# EAGLE schematic AirSensor_LoRA (EAGLE 9.6.2)
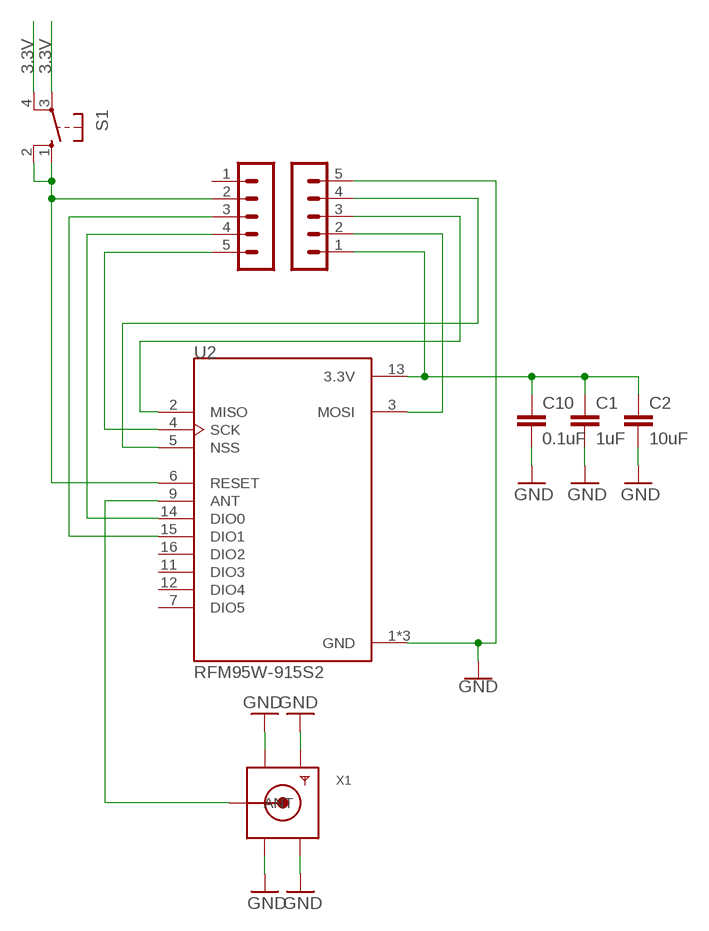
[diagram p0: schematic, sheet 1]

## Parts
C1  1uF  1.0UF-0805-25V-10%  [0805]
C2  10uF  1.0UF-0805-25V-10%  [0805]
C10  0.1uF  1.0UF-0805-25V-10%  [0805]
RFM95W_1  LoRa_1  MA05-1  [MA05-1]
RFM95W_2  LoRa_2  MA05-1  [MA05-1]
S1  10-XX  [B3F-10XX]
U2  RFM95W-915S2  [XCVR_RFM95W-915S2]
X1  SMACONNECTOR_EDGE  [SMA_EDGELAUNCH]

## Nets
3.3V: S1.3(P) S1.4(P1)
GND: C1.2 C2.2 C10.2 RFM95W_2.5 U2.1(GND) U2.8(GND) U2.10(GND) X1.GND@1(GND4) X1.GND@2(GND3) X1.GND@3(GND2) X1.GND@4(GND1)
N$13: RFM95W_1.2 S1.1(S) S1.2(S1) U2.6(RESET)
N$17: C1.1 C2.1 C10.1 RFM95W_2.1 U2.13(3.3V)
N$18: RFM95W_2.2 U2.3(MOSI)
N$21: RFM95W_2.3 U2.2(MISO)
N$22: RFM95W_2.4 U2.5(NSS)
N$23: RFM95W_1.5 U2.4(SCK)
N$24: RFM95W_1.4 U2.14(DIO0)
N$25: RFM95W_1.3 U2.15(DIO1)
N$26: U2.9(ANT) X1.P(ANT)
Unconnected: RFM95W_1.1 U2.7(DIO5) U2.11(DIO3) U2.12(DIO4) U2.16(DIO2)

## Library data of the parts
C1 C2 C10 = SparkFun-Capacitors:1.0UF: 1µF ceramic capacitors A capacitor is a passive two-terminal electrical component used to store electrical energy temporarily in an electric field.; PROD_ID: CAP-08064; VALUE: 1.0uF
RFM95W_1 RFM95W_2 = con-lstb:MA05-1: PIN HEADER; OC_FARNELL: unknown; OC_NEWARK: unknown
S1 = switch-omron:10-XX: OMRON SWITCH; MPN: B3F-1000; OC_FARNELL: 176432; OC_NEWARK: 36M3542
U2 = RFM95W-915S2:RFM95W-915S2: RFM95(W) - Low Power Long Range Transceiver Module V1.0 Check prices <https://pricing.snapeda.com/search/part/RFM95W-915S2/?ref=eda>; AVAILABILITY: Warning; DESCRIPTION: General ISM < 1GHz LoRa™ Transceiver Module 915MHz Surface Mount; MF: RF Solutions; MP: RFM95W-915S2; PACKAGE: SMD-16 RF Solutions; PRICE: None; PURCHASE-URL: https://pricing.snapeda.com/search/part/RFM95W-915S2/?ref=eda
X1 = adafruit:SMACONNECTOR: SMA Connector 90° DIP SMA Connector, 50 Ohm (4UConnector: 07259)